# EAGLE design MotorController.v0.1 (EAGLE 7.6.0)
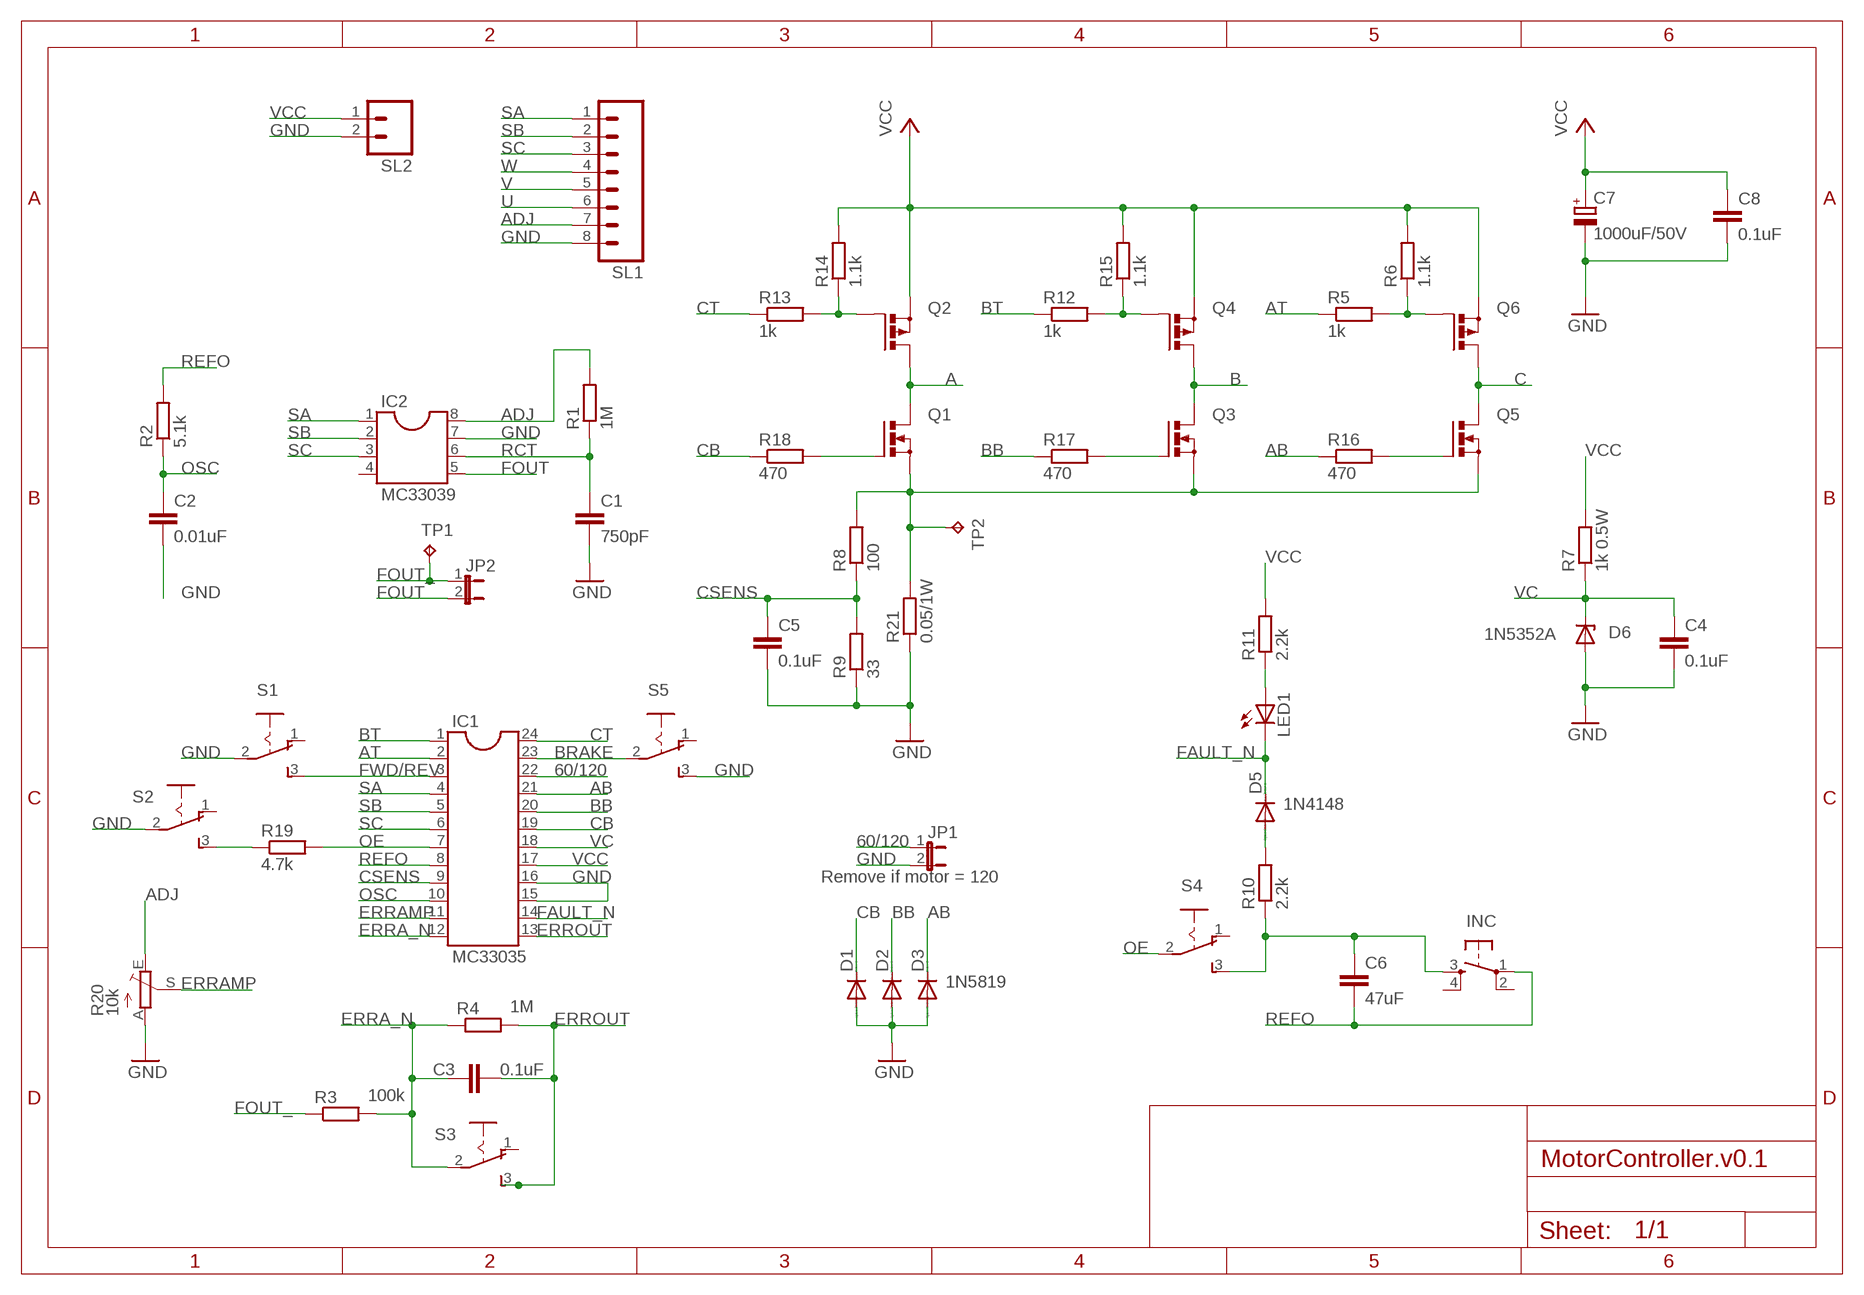
[diagram p0: schematic, sheet 1]

## Parts
C1  750pF  C-EU025-025X050  [C025-025X050]
C2  0.01uF  C-EU025-025X050  [C025-025X050]
C3  0.1uF  C-EU025-025X050  [C025-025X050]
C4  0.1uF  C-EU025-025X050  [C025-025X050]
C5  0.1uF  C-EU025-025X050  [C025-025X050]
C6  47uF  C-EU025-025X050  [C025-025X050]
C7  1000uF/50V  CPOL-EUE7.5-16  [E7,5-16]
C8  0.1uF  C-EU025-025X050  [C025-025X050]
D1  1N4148DO35-7  [DO35-7]
D2  1N4148DO35-7  [DO35-7]
D3  1N5819  1N4148DO35-7  [DO35-7]
D5  1N4148  1N4148DO35-7  [DO35-7]
D6  1N5352A  BZV10  [DO34Z7]
IC1  MC33035  DIL24-3  [DIL24-3]
IC2  MC33039  DIL8S  [SOCKET-08]
INC  TAC_SWITCHPTH  [TACTILE-PTH]
JP1  JP1E  [JP1]
JP2  JP1E  [JP1]
LED1  LEDLD260  [LD260]
Q1  PMOSFET_NTO220BV  [TO220BV]
Q2  PMOSFET_PTO220BV  [TO220BV]
Q3  PMOSFET_NTO220BV  [TO220BV]
Q4  PMOSFET_PTO220BV  [TO220BV]
Q5  PMOSFET_NTO220BV  [TO220BV]
Q6  PMOSFET_PTO220BV  [TO220BV]
R1  1M  R-EU_0204/2V  [0204V]
R2  5.1k  R-EU_0204/2V  [0204V]
R3  100k  R-EU_0204/2V  [0204V]
R4  1M  R-EU_0204/2V  [0204V]
R5  1k  R-EU_0204/2V  [0204V]
R6  1.1k  R-EU_0204/2V  [0204V]
R7  1k 0.5W  R-EU_0204/2V  [0204V]
R8  100  R-EU_0204/2V  [0204V]
R9  33  R-EU_0204/2V  [0204V]
R10  2.2k  R-EU_0204/2V  [0204V]
R11  2.2k  R-EU_0204/2V  [0204V]
R12  1k  R-EU_0204/2V  [0204V]
R13  1k  R-EU_0204/2V  [0204V]
R14  1.1k  R-EU_0204/2V  [0204V]
R15  1.1k  R-EU_0204/2V  [0204V]
R16  470  R-EU_0204/2V  [0204V]
R17  470  R-EU_0204/2V  [0204V]
R18  470  R-EU_0204/2V  [0204V]
R19  4.7k  R-EU_0204/2V  [0204V]
R20  10k  TRIM_EU-CA6V  [CA6V]
R21  0.05/1W  R-EU_0204/2V  [0204V]
S1  M251  [M251]
S2  M251  [M251]
S3  M251  [M251]
S4  M251  [M251]
S5  M251  [M251]
SL1  M08  [08P]
SL2  M02  [02P]
TP1  TPPAD1-13Y  [P1-13Y]
TP2  TPPAD1-13Y  [P1-13Y]

## Nets
60/120: IC1.22 JP1.1
A: Q1.D Q2.D
AB: D3.C IC1.21 R16.1
ADJ: IC2.8 R1.2 R20.E SL1.7
AT: IC1.2 R5.1
B: Q3.D Q4.D
BB: D2.C IC1.20 R17.1
BRAKE: IC1.23 S5.2(P)
BT: IC1.1 R12.1
C: Q5.D Q6.D
CB: D1.C IC1.19 R18.1
CSENS: C5.1 IC1.9 R8.1 R9.2
CT: IC1.24 R13.1
ERRA_N: C3.1 IC1.12 R3.2 R4.1 S3.2(P)
ERRAMP: IC1.11 R20.S
ERROUT: C3.2 IC1.13 R4.2 S3.3(S)
FAULT_N: D5.C IC1.14 LED1.K(C)
FOUT: IC2.5 JP2.2
FOUT_: JP2.1 R3.1 TP1.TP
FWD/REV: IC1.3 S1.3(S)
GND: C1.2 C2.2 C4.2 C5.2 C7.- C8.2 D1.A D2.A D3.A D6.A IC1.15 IC1.16 IC2.7 JP1.2 R9.1 R20.A R21.1 S1.2(P) S2.2(P) S5.3(S) SL1.8 SL2.2
N$1: R19.1 S2.3(S)
N$2: LED1.A R11.1
N$3: Q3.G R17.2
N$4: Q5.G R16.2
N$5: Q6.G R5.2 R6.1
N$6: D5.A R10.2
N$7: Q1.S Q3.S Q5.S R8.2 R21.2 TP2.TP
N$8: Q4.G R12.2 R15.1
N$9: Q2.G R13.2 R14.1
N$10: Q1.G R18.2
N$11: C6.1 INC.3 R10.1 S4.3(S)
OE: IC1.7 R19.2 S4.2(P)
OSC: C2.1 IC1.10 R2.1
RCT: C1.1 IC2.6 R1.1
REFO: C6.2 IC1.8 INC.1 R2.2
SA: IC1.4 IC2.1 SL1.1
SB: IC1.5 IC2.2 SL1.2
SC: IC1.6 IC2.3 SL1.3
U: SL1.6
V: SL1.5
VC: C4.1 D6.C IC1.18 R7.1
VCC: C7.+ C8.1 IC1.17 Q2.S Q4.S Q6.S R6.2 R7.2 R11.2 R14.2 R15.2 SL2.1
W: SL1.4
Unconnected: IC2.4 INC.2 INC.4 S1.1(O) S2.1(O) S3.1(O) S4.1(O) S5.1(O)

## Notes on the sheet
- Remove if motor = 120

## Library data of the parts
C1-C6 C8 = rcl:C-EU: CAPACITOR, European symbol
C7 = rcl:CPOL-EU: POLARIZED CAPACITOR, European symbol
D1-D3 D5 = diode:1N4148: DIODE high speed (Philips)
D6 = diode:BZV10: Z DIODE
IC1 = ic-package:DIL24: Dual In Line
IC2 = ic-package:DIL8: Dual In Line / Socket
INC = SparkFun:TAC_SWITCH: Momentary Switch Button commonly used for reset or general input. Spark Fun Electronics SKU : COM-00097
JP1 JP2 = jumper:JP1E: JUMPER
LED1 = led:LED: LED OSRAM: - CHIPLED LG R971, LG N971, LY N971, LG Q971, LY Q971, LO R971, LY R971 LH N974, LH R974 LS Q976, LO Q976, LY Q976 LO Q996 - Hyper CHIPLED LW Q18S LB Q993, LB Q99A, LB R99A - SideLED LS A670, LO A670, LY A670, LG A670, LP A670 LB A673, LV A673, LT A673, LW A673 LH A674 LY A675 LS A676, LA A676, LO A676, LY A676, LW A676 LS A679, LY A679, LG A679 - Hyper Micro SIDELED® LS Y876, LA Y876, LO Y876, LY Y876 LT Y87S - SmartLED LW L88C, LW L88S LB L89C, LB L89S, LG L890 LS L89K, LO L89K, LY L89K LS L896, LA L896, LO L896, LY L896 - TOPLED LS T670, LO T670, LY T670, LG T670, LP T670 LSG T670, LSP T670, LSY T670, LOP T670, LYG T670 LG T671, LOG T671, LSG T671 LB T673, LV T673, LT T673, LW T673 LH T674 LS T676, LA T676, LO T676, LY T676, LB T676, LH T676, LSB T676, LW T676 LB T67C, LV T67C, LT T67C, LS T67K, LO T67K, LY T67K, LW E67C LS E67B, LA E67B, LO E67B, LY E67B, LB E67C, LV E67C, LT E67C LW T67C LS T679, LY T679, LG T679 LS T770, LO T770, LY T770, LG T770, LP T770 LB T773, LV T773, LT T773, LW T773 LH T774 LS E675, LA E675, LY E675, LS T675 LS T776, LA T776, LO T776, LY T776, LB T776 LHGB T686 LT T68C, LB T68C - Hyper Mini TOPLED® LB M676 - Mini TOPLED Santana® LG M470 LS M47K, LO M47K, LY M47K Source: http://www.osram.convergy.de LUXEON: - LUMILED® LXK2-PW12-R00, LXK2-PW12-S00, LXK2-PW14-U00, LXK2-PW14-V00 LXK2-PM12-R00, LXK2-PM12-S00, LXK2-PM14-U00 LXK2-PE12-Q00, LXK2-PE12-R00, LXK2-PE12-S00, LXK2-PE14-T00, LXK2-PE14-U00 LXK2-PB12-K00, LXK2-PB12-L00, LXK2-PB12-M00, LXK2-PB14-N00, LXK2-PB14-P00, LXK2-PB14-Q00 LXK2-PR12-L00, LXK2-PR12-M00, LXK2-PR14-Q00, LXK2-PR14-R00 LXK2-PD12-Q00, LXK2-PD12-R00, LXK2-PD12-S00 LXK2-PH12-R00, LXK2-PH12-S00 LXK2-PL12-P00, LXK2-PL12-Q00, LXK2-PL12-R00 Source: www.luxeon.com KINGBRIGHT: KA-3528ASYC Source: www.kingbright.com
Q1 Q3 Q5 = transistor-power:PMOSFET_N: Power MOSFET N-Channel
Q2 Q4 Q6 = transistor-power:PMOSFET_P: Power MOSFET P-Channel
R1-R19 R21 = resistor:R-EU_: RESISTOR, European symbol
R20 = pot:TRIM_EU-: POTENTIOMETER
S1-S5 = switch:M251: SLIDING SWITCH Mors, distributor Buerklin, 11G702
SL1 = con-amp-quick:M08: AMP QUICK CONNECTOR; OC_FARNELL: unknown; OC_NEWARK: unknown
SL2 = con-amp-quick:M02: AMP QUICK CONNECTOR; OC_FARNELL: unknown; OC_NEWARK: unknown
TP1 TP2 = testpad:TP: Test pad

## Board
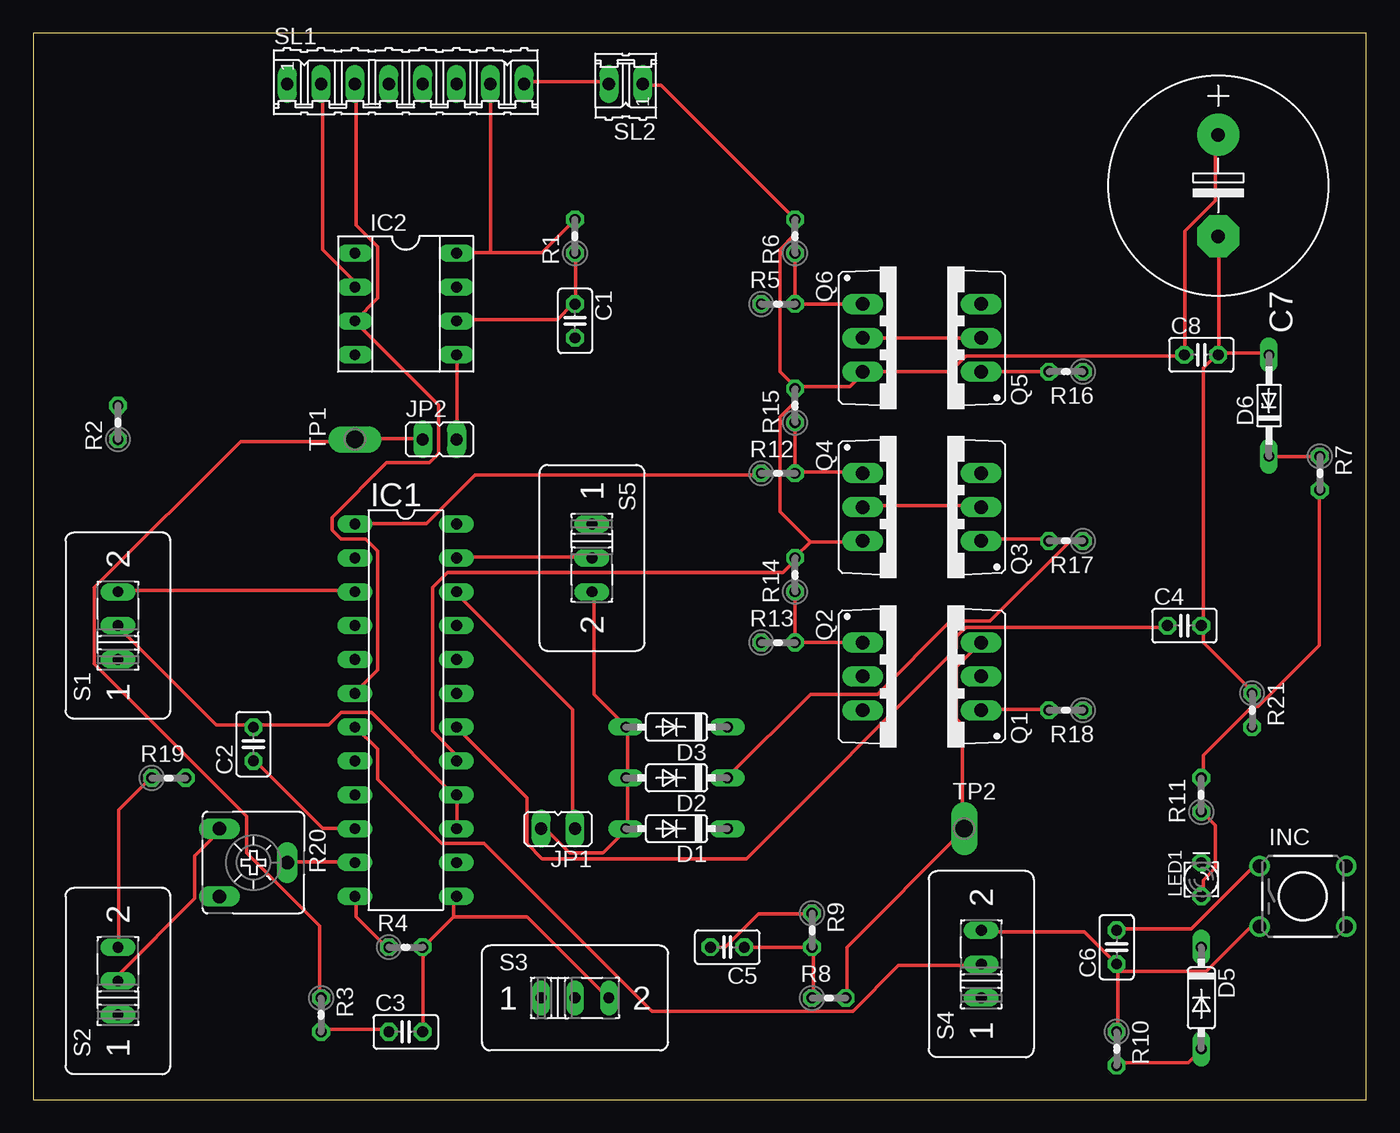
[diagram p1: board, top side]
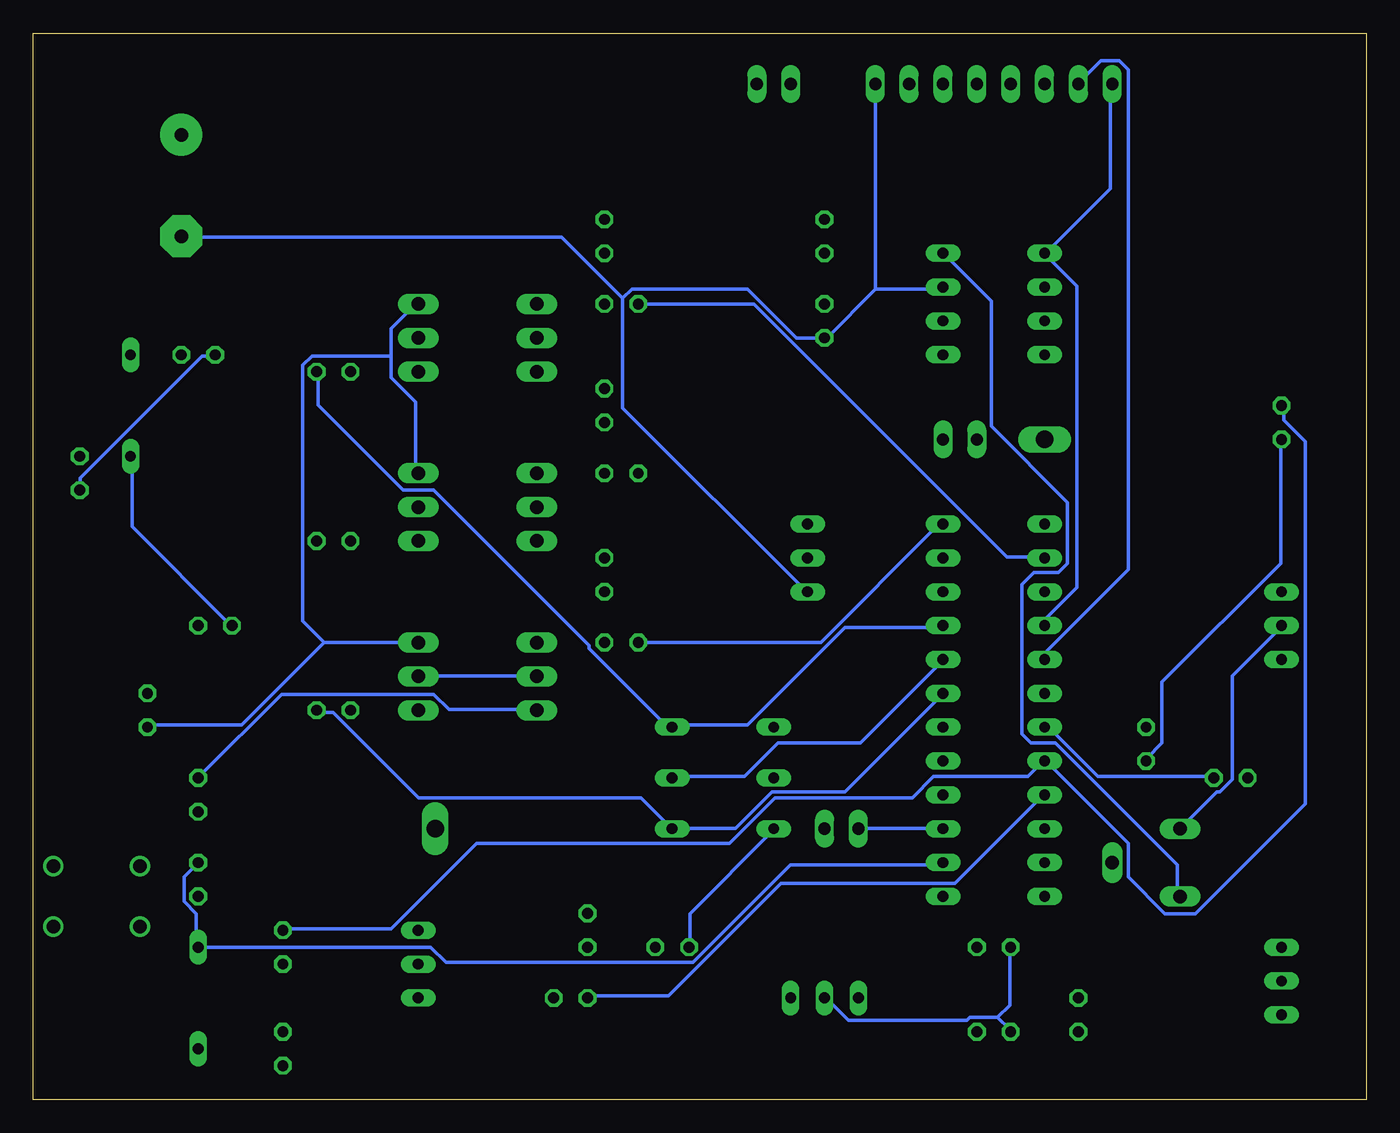
[diagram p2: board, bottom side, seen from below]

Size 100 x 80 mm. Coordinates in mm from the lower left corner, seen from the top.
Outline: 0,0 100,0 100,80 0,80 0,0
Copper layers (1*16): Top 0.035mm / dielectric 1.5mm / Bottom 0.035mm
Design rules "default": minimum track width 10mil, minimum drill 24mil, track to track 8mil, track to pad 8mil, pad to pad 8mil, via to via 8mil, smd to smd 8mil, copper to edge 40mil, drill to drill 8mil, minimum pad ring 10mil, minimum via ring 8mil, stop-mask expansion 4mil, vias tented up to drill 0mil, thermal gap 10mil

### Footprints (pad centres in the part's own frame; a part is rotated, then mirrored left to right if it is on the bottom)
C025-025X050 = drill 0.813 octagon: 1 -1.27,0; 2 1.27,0
E7,5-16 = drill 1.016 pad 3.15: + -3.81,0 | drill 1.016 pad 3.15 octagon: - 3.81,0
DO35-7 = drill 0.813 long: A 3.81,0; C -3.81,0
DO34Z7 = drill 0.813 long: A 3.81,0; C -3.81,0
DIL24-3 = drill 0.813 long: 1 -13.97,-3.81; 2 -11.43,-3.81; 3 -8.89,-3.81; 4 -6.35,-3.81; 5 -3.81,-3.81; 6 -1.27,-3.81; 7 1.27,-3.81; 8 3.81,-3.81; 9 6.35,-3.81; 10 8.89,-3.81; 11 11.43,-3.81; 12 13.97,-3.81; 13 13.97,3.81; 14 11.43,3.81; 15 8.89,3.81; 16 6.35,3.81; 17 3.81,3.81; 18 1.27,3.81; 19 -1.27,3.81; 20 -3.81,3.81; 21 -6.35,3.81; 22 -8.89,3.81; 23 -11.43,3.81; 24 -13.97,3.81
SOCKET-08 = drill 0.813 long: 1 -3.81,-3.81; 2 -1.27,-3.81; 3 1.27,-3.81; 4 3.81,-3.81; 5 3.81,3.81; 6 1.27,3.81; 7 -1.27,3.81; 8 -3.81,3.81
TACTILE-PTH = drill 1.016: 1 -3.251,2.261; 2 3.251,2.261; 3 -3.251,-2.261; 4 3.251,-2.261
JP1 = drill 0.914 long: 1 0,-1.27; 2 0,1.27
LD260 = drill 0.813 octagon: A -1.27,0; K 1.27,0
TO220BV = drill 1.016 long: D 0,-2.54; G -2.54,-2.54; S 2.54,-2.54
0204V = drill 0.813 octagon: 1 -1.27,0; 2 1.27,0
CA6V = drill 1.016 long: A -2.54,-2.54; E 2.54,-2.54; S 0,2.54
M251 = drill 0.813 long: 1 -2.54,0; 2 0,0; 3 2.54,0
08P = drill 0.914 long: 1 -8.89,0; 2 -6.35,0; 3 -3.81,0; 4 -1.27,0; 5 1.27,0; 6 3.81,0; 7 6.35,0; 8 8.89,0
02P = drill 0.914 long: 1 -1.27,0; 2 1.27,0
P1-13Y = drill 1.321 pad 1.905 long: TP 0,0

### Placement (x,y rotation side)
C1  40.64,58.42 270 top
C2  16.51,26.67 90 top
C3  27.94,5.08 0 top
C4  86.36,35.56 0 top
C5  52.07,11.43 180 top
C6  81.28,11.43 90 top
C7  88.9,68.58 270 top
C8  87.63,55.88 0 top
D1  48.26,20.32 180 top
D2  48.26,24.13 180 top
D3  48.26,27.94 180 top
D5  87.63,7.62 270 top
D6  92.71,52.07 90 top
IC1  27.94,29.21 270 top
IC2  27.94,59.69 270 top
INC  95.25,15.24 0 top
JP1  39.37,20.32 90 top
JP2  30.48,49.53 270 top
LED1  87.63,16.51 90 top
Q1  68.58,31.75 90 top
Q2  64.77,31.75 270 top
Q3  68.58,44.45 90 top
Q4  64.77,44.45 270 top
Q5  68.58,57.15 90 top
Q6  64.77,57.15 270 top
R1  40.64,64.77 90 top
R2  6.35,50.8 90 top
R3  21.59,6.35 270 top
R4  27.94,11.43 0 top
R5  55.88,59.69 0 top
R6  57.15,64.77 90 top
R7  96.52,46.99 270 top
R8  59.69,7.62 0 top
R9  58.42,12.7 270 top
R10  81.28,3.81 270 top
R11  87.63,22.86 90 top
R12  55.88,46.99 0 top
R13  55.88,34.29 0 top
R14  57.15,39.37 90 top
R15  57.15,52.07 90 top
R16  77.47,54.61 180 top
R17  77.47,41.91 180 top
R18  77.47,29.21 180 top
R19  10.16,24.13 0 top
R20  16.51,17.78 270 top
R21  91.44,29.21 270 top
S1  6.35,35.56 90 top
S2  6.35,8.89 90 top
S3  40.64,7.62 0 top
S4  71.12,10.16 90 top
S5  41.91,40.64 270 top
SL1  27.94,76.2 0 top
SL2  44.45,76.2 180 top
TP1  24.13,49.53 90 top
TP2  69.85,20.32 0 top

### Tracks (layer width: path | path; a pad name or v marks a point on that pad's centre or on a via)
60/120
  Top 0.254: IC1.22 31.77,37.95 40.46,29.26 40.46,20.34 JP1.1
A
  Bottom 0.254: Q2.D 62.41,31.77 71.09,31.77 Q1.D
AB
  Bottom 0.254: IC1.21 31.77,35.43 39.09,35.43 46.41,28.12 51.89,28.12 D3.C 52.12,28.12 52.58,28.12 58.29,33.83 58.29,34.06 69.95,45.72 72.24,45.72 78.64,52.12 78.64,54.41 R16.1
ADJ
  Top 0.254: 34.29,63.55 38.18,63.55 40.46,65.84 R1.2 | 34.29,63.55 31.77,63.55 IC2.8 | 34.29,63.55 SL1.7
  Bottom 0.254: R20.E 14.17,15.32 14.17,17.6 23.32,26.75 25.15,26.75 25.83,27.43 25.83,38.63 24.92,39.55 23.09,39.55 22.4,40.23 22.4,44.81 28.12,50.52 28.12,59.89 31.55,63.32 IC2.8
AT
  Bottom 0.254: IC1.2 24.23,40.69 26.98,40.69 45.95,59.66 54.41,59.66 R5.1
B
  Top 0.254: Q4.D 62.41,44.58 71.09,44.58 Q3.D
BB
  Top 0.254: R17.1 78.64,41.83 77.72,41.83 71.78,35.89 68.81,35.89 63.32,30.4 58.29,30.4 52.12,24.23 D2.C
  Bottom 0.254: D2.C 51.89,24.23 46.63,24.23 44.12,26.75 37.95,26.75 31.77,32.92 IC1.20
BRAKE
  Top 0.254: IC1.23 31.77,40.69 41.83,40.69 S5.2
BT
  Top 0.254: IC1.1 24.23,43.2 29.49,43.2 33.15,46.86 54.41,46.86 R12.1
C
  Top 0.254: Q5.D Q6.D
CB
  Bottom 0.254: IC1.19 31.77,30.4 39.09,23.09 44.58,23.09 47.32,20.34 51.89,20.34 D1.C 52.12,20.34 54.41,22.63 71.09,22.63 77.5,29.03 78.64,29.03 R18.1
CSENS
  Top 0.254: C5.1 R9.2 58.52,11.43 58.52,7.77 R8.1
  Bottom 0.254: IC1.9 24.23,22.86 30.86,16.23 43.89,16.23 52.35,7.77 58.29,7.77 R8.1
CT
  Bottom 0.254: R13.1 40.92,34.29 32.23,42.98 31.77,42.98 IC1.24
ERRA_N
  Top 0.254: IC1.12 24.23,15.09 24.23,13.72 26.52,11.43 R4.1 | R3.2 21.72,5.26 26.52,5.26 C3.1
  Bottom 0.254: 27.66,6.17 29.72,6.17 29.95,5.94 38.86,5.94 40.46,7.54 S3.2 | 27.66,6.17 26.75,5.26 C3.1 | 27.66,6.17 26.75,7.09 26.75,11.43 R4.1
ERRAMP
  Top 0.254: IC1.11 24,17.83 19.2,17.83 R20.S
ERROUT
  Top 0.254: 29.26,11.43 29.26,5.26 C3.2 | 31.55,13.72 31.55,15.09 IC1.13 | 29.26,11.43 31.55,13.72 | 29.26,11.43 R4.2 | 31.55,13.72 37.03,13.72 42.98,7.77 S3.3
FAULT_N
  Bottom 0.254: LED1.K 87.78,17.6 88.7,16.69 88.7,14.86 87.78,13.95 87.78,11.43 D5.C 70.18,11.43 69.04,10.29 50.52,10.29 43.2,17.6 31.77,17.6 IC1.14
FOUT
  Top 0.254: IC2.5 31.77,55.78 31.77,49.61 JP2.2
FOUT_
  Top 0.254: R3.1 21.49,7.77 21.49,13.03 16,18.52 16,21.26 4.57,32.69 4.57,38.41 15.54,49.38 24,49.38 TP1.TP 24.23,49.61 29.03,49.61 JP2.1
FWD/REV
  Top 0.254: S1.3 6.4,38.18 24,38.18 IC1.3
GND
  Top 0.254: R21.1 91.44,30.63 87.78,34.29 87.78,35.43 C4.2 87.78,35.66 87.78,54.86 88.7,55.78 C8.2 88.92,56.01 | 88.92,56.01 92.58,56.01 D6.A | 88.92,56.01 88.92,64.69 C7.- | SL1.8 37.03,76.35 42.98,76.35 SL2.2 | S2.2 6.4,8.91 6.4,9.37 12.12,15.09 12.12,18.29 13.95,20.12 R20.A | S1.2 6.4,35.43 13.72,28.12 16.46,28.12 C2.2 16.69,28.12 22.17,28.12 23.09,29.03 25.38,29.03 31.55,22.86 IC1.16 31.77,22.86 31.77,20.34 IC1.15 | C5.2 51.89,11.43 54.41,13.95 58.29,13.95 R9.1 | S5.3 42.06,37.95 42.06,30.4 44.35,28.12 D3.A 44.58,27.89 44.58,24.23 D2.A 44.58,24 44.58,20.34 D1.A 44.35,20.12 42.75,18.52 40.23,18.52 38.63,20.12 38.18,20.12 JP1.2
  Bottom 0.254: 36.8,60.81 31.77,60.81 IC2.7 | 36.8,60.81 40.46,57.15 C1.2 42.75,57.15 46.41,60.81 55.09,60.81 55.78,60.12 | 36.8,60.81 36.8,76.12 SL1.8 | JP1.2 37.95,20.34 31.77,20.34 IC1.15 | C5.2 50.75,11.43 50.75,13.95 44.58,20.12 D1.A | R20.A 11.2,23.09 10.97,23.09 10.06,24 10.06,31.77 6.4,35.43 S1.2 | 55.78,60.12 55.78,51.89 42.06,38.18 S5.3 | 55.78,60.12 60.35,64.69 88.7,64.69 C7.-
N$1
  Top 0.254: S2.3 6.4,11.43 6.4,21.72 8.69,24 R19.1
N$2
  Top 0.254: LED1.A 87.78,15.32 87.78,16.46 88.7,17.37 88.7,20.57 87.78,21.49 R11.1
N$3
  Top 0.254: R17.2 76.12,42.06 71.32,42.06 Q3.G
N$4
  Top 0.254: R16.2 76.12,54.63 71.32,54.63 Q5.G
N$5
  Top 0.254: R6.1 R5.2 57.15,59.66 62.18,59.66 Q6.G
N$6
  Top 0.254: R10.2 81.38,2.74 86.64,2.74 87.55,3.66 D5.A
N$7
  Top 0.254: R8.2 61.04,7.77 61.04,11.43 69.72,20.12 TP2.TP 69.72,20.34 69.72,28.12 69.27,28.57 69.27,32.46 71.09,34.29 Q1.S
  Bottom 0.254: 73.15,55.78 73.15,57.84 71.32,59.66 Q5.S | 73.15,55.78 73.15,54.18 71.32,52.35 71.32,47.09 Q3.S | 78.18,34.29 84.35,28.12 91.44,28.12 R21.2 | Q1.S 78.18,34.29 | 73.15,55.78 79.1,55.78 79.78,55.09 79.78,35.89 78.18,34.29
N$8
  Top 0.254: R15.1 57.15,47.09 | 57.15,47.09 62.18,47.09 Q4.G | 57.15,47.09 R12.2
N$9
  Top 0.254: R14.1 R13.2 Q2.G
N$10
  Top 0.254: R18.2 76.12,29.26 71.32,29.26 Q1.G
N$11
  Top 0.254: 81.38,9.6 81.38,10.06 C6.1 | 81.38,9.6 81.38,5.26 R10.1 | C6.1 78.87,12.57 71.32,12.57 S4.3 | 81.38,9.6 88.01,9.6 91.21,12.8 91.9,12.8 INC.3 | 81.38,9.6 C6.1
OE
  Top 0.254: S4.2 71.09,10.06 64.92,10.06 61.49,6.63 46.41,6.63 33.83,19.2 30.63,19.2 25.83,24 25.83,26.29 24.23,27.89 IC1.7
  Bottom 0.254: R19.2 11.43,24.23 20.12,24.23 24,28.12 IC1.7
OSC
  Top 0.254: IC1.10 24,20.34 21.72,20.34 16.69,25.38 C2.1
  Bottom 0.254: R2.1 6.4,49.38 6.4,40.23 15.32,31.32 15.32,26.75 16.46,25.6 C2.1
RCT
  Top 0.254: IC2.6 31.77,58.52 39.32,58.52 40.46,59.66 C1.1 40.69,59.89 40.69,63.32 R1.1
REFO
  Top 0.254: C6.2 81.38,12.8 86.87,12.8 91.44,17.37 91.9,17.37 INC.1
  Bottom 0.254: R2.2 6.17,51.89 6.17,50.98 4.57,49.38 4.57,22.17 12.8,13.95 15.09,13.95 17.83,16.69 17.83,19.2 24,25.38 IC1.8 24.23,25.38 25.38,24.23 32.46,24.23 34.06,22.63 44.35,22.63 47.78,19.2 66.75,19.2 73.15,12.8 81.15,12.8 C6.2
SA
  Bottom 0.254: IC1.4 24,35.66 24,36.12 21.72,38.41 21.72,61.04 24,63.32 IC2.1 24,63.55 19.2,68.35 19.2,76.12 SL1.1
SB
  Top 0.254: IC2.2 24,61.04 24,61.49 21.72,63.78 21.72,76.12 SL1.2
  Bottom 0.254: IC1.5 24,33.15 24,33.6 17.83,39.78 17.83,77.27 18.52,77.95 19.89,77.95 21.49,76.35 SL1.2
SC
  Top 0.254: IC1.6 24.23,30.63 25.83,32.23 25.83,41.15 24.92,42.06 23.09,42.06 22.4,42.75 22.4,43.66 26.52,47.78 29.72,47.78 30.4,48.46 30.4,52.12 24.23,58.29 IC2.3 25.83,60.12 25.83,64.01 24.23,65.61 24.23,76.12 SL1.3
VC
  Top 0.254: D6.C 92.81,48.23 96.47,48.23 R7.1 | IC1.18 31.77,27.89 37.03,22.63 37.03,19.2 38.18,18.06 53.49,18.06 69.27,33.83 69.27,34.75 69.95,35.43 85.04,35.43 C4.1
  Bottom 0.254: D6.C 92.58,48.23 92.58,42.98 85.27,35.66 C4.1
VCC
  Top 0.254: 57.15,53.49 61.27,53.49 62.18,54.41 Q6.S 62.41,54.63 68.81,54.63 69.95,55.78 86.18,55.78 C8.1 86.41,56.01 86.41,65.15 88.7,67.44 88.7,72.24 C7.+ | 57.15,53.49 56.01,54.63 56.01,63.78 57.15,64.92 R6.2 57.15,66.06 47.09,76.12 45.72,76.12 SL2.1 | 57.15,53.49 R15.2 57.15,52.35 56.01,51.21 56.01,44.12 58.29,41.83 | IC1.17 31.55,25.6 31.55,26.06 29.95,27.66 29.95,38.41 31.09,39.55 56.24,39.55 57.15,40.46 R14.2 57.15,40.69 58.29,41.83 | 58.29,41.83 62.18,41.83 Q4.S | R11.2 87.78,24.23 87.78,25.83 91.44,29.49 91.9,29.49 96.47,34.06 96.47,45.72 R7.2
  Bottom 0.254: C8.1 86.41,55.78 87.33,55.78 96.47,46.63 96.47,45.72 R7.2 | Q2.S 62.41,29.26 68.81,29.26 69.95,30.4 81.38,30.4 87.55,24.23 R11.2